# Altium schematic sheet cond_sinais.SchDoc: Condicionamento
size A4; Author: Matheus Gois Vieira; Organization: UnB; Address1: Faculdade do Gama
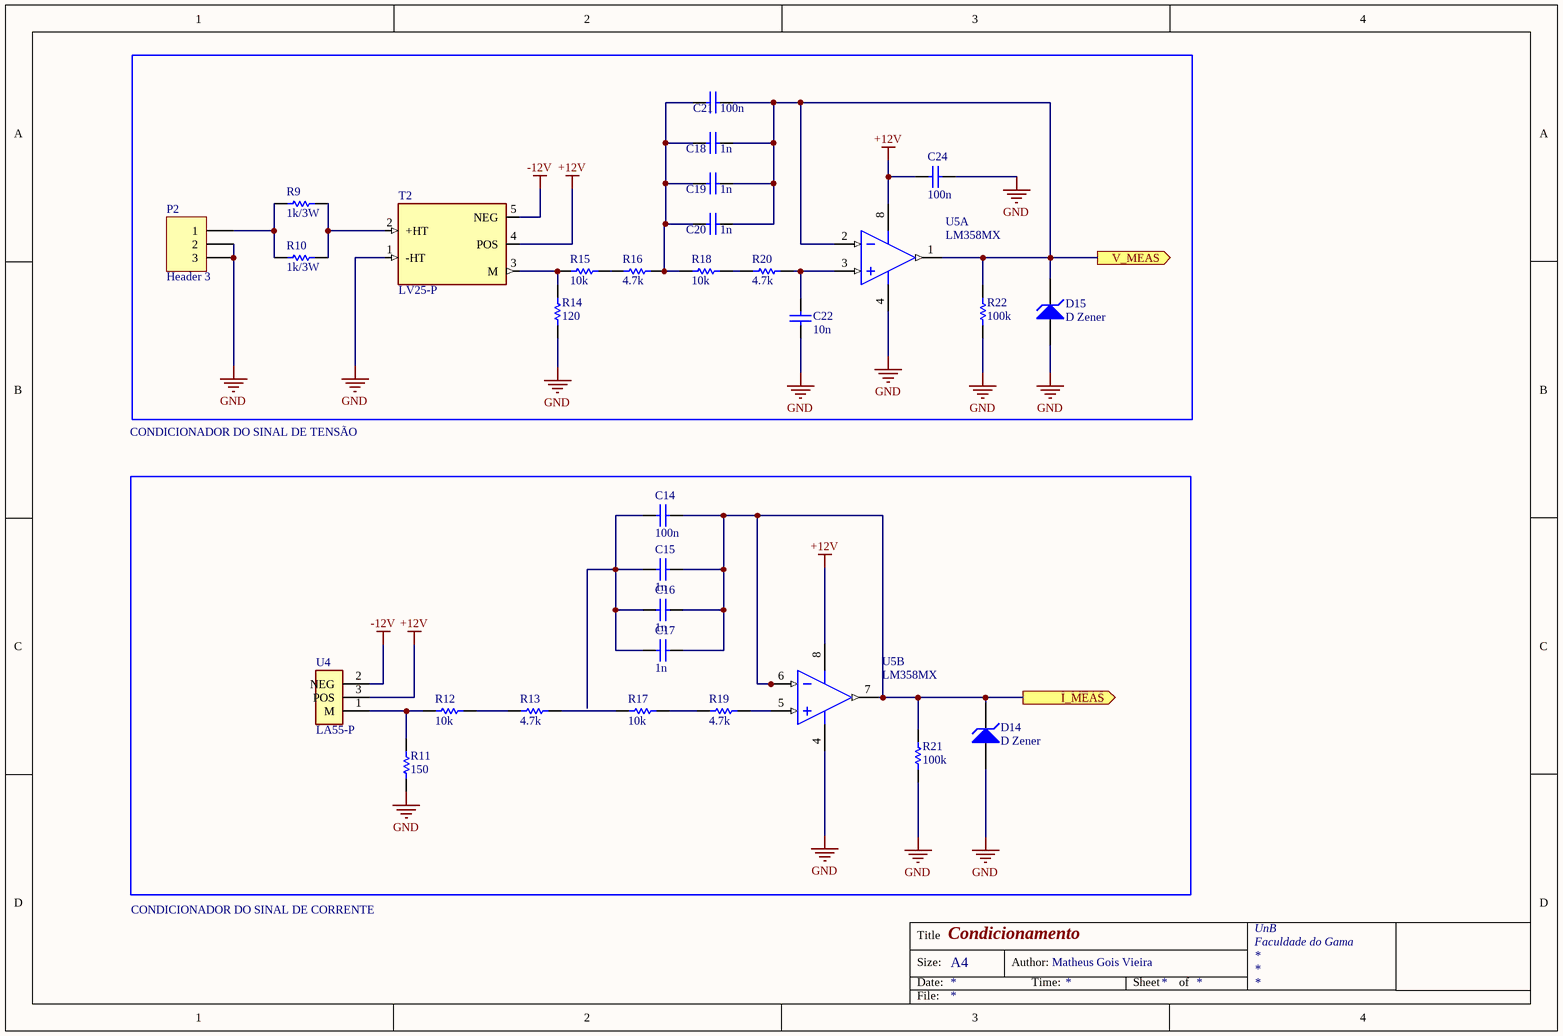
[diagram p0: cond_sinais.SchDoc]

## Parts
C14  100n  [C0603[0201]]
C15  1n  [C0603[0201]]
C16  1n  [C0603[0201]]
C17  1n  [C0603[0201]]
C18  1n  [C0603[0201]]
C19  1n  [C0603[0201]]
C20  1n  [C0603[0201]]
C21  100n  [C0603[0201]]
C22  10n  [C0603[0201]]
C24  100n  [C0603[0201]]
D14  D Zener  [DIODE-SIGNAL]
D15  D Zener  [DIODE-SIGNAL]
P2  Header 3  [HDR1X3]
R9  1k/3W  [R1005[0402]]
R10  1k/3W  [R1005[0402]]
R11  150  [R1005[0402]]
R12  10k  [R1608[0603]]
R13  4.7k  [R1005[0402]]
R14  120  [R1005[0402]]
R15  10k  [R1608[0603]]
R16  4.7k  [R1005[0402]]
R17  10k  [R1005[0402]]
R18  10k  [R1005[0402]]
R19  4.7k  [R1005[0402]]
R20  4.7k  [R1005[0402]]
R21  100k  [R1005[0402]]
R22  100k  [R1005[0402]]
T2  LV25-P  [XDCR_LV25-P]
U4  LA55-P  [XDCR_LA55-P]
U5  LM358MX  [M08A_N]  (parts A,B of 2)

## Ports
I_MEAS (out), V_MEAS (out)

## Nets
+12V: C24.2 T2.4(POS) U4.3(POS) U5.8(V+)
-12V: T2.5(NEG) U4.2(NEG)
GND: C22.1 C24.1 D14.1(A) D15.1(A) P2.2 P2.3 R11.1 R14.1 R21.1 R22.1 T2.1(-HT) U5.4(GND)
I_MEAS: C14.2 C15.2 C16.2 C17.2 D14.2(K) R21.2 U5.6(INB-) U5.7(OUTB) ; port I_MEAS
V_MEAS: C18.2 C19.2 C20.2 C21.2 D15.2(K) R22.2 U5.1(OUTA) U5.2(INA-) ; port V_MEAS
NetC14_1: C14.1 C15.1 C16.1 C17.1
NetC18_1: C18.1 C19.1 C20.1 C21.1 R16.2 R18.1
NetC22_2: C22.2 R20.2 U5.3(INA+)
NetP2_1: P2.1 R9.1 R10.1
NetR9_2: R9.2 R10.2 T2.2(+HT)
NetR11_2: R11.2 R12.1 U4.1(M)
NetR12_2: R12.2 R13.1
NetR13_2: R13.2 R17.1
NetR14_2: R14.2 R15.1 T2.3(M)
NetR15_2: R15.2 R16.1
NetR17_2: R17.2 R19.1
NetR18_2: R18.2 R20.1
NetR19_2: R19.2 U5.5(INB+)

## Notes on the sheet
- CONDICIONADOR DO SINAL DE TENSÃO
- CONDICIONADOR DO SINAL DE CORRENTE
- Title
- Size:
- Date:
- A4
- Author:
- Time:
- Sheet
- of
- File:

## Library data of the parts
C14 C21 C22 = C: CAP CER 10000PF 50V X7R 0603; Manufacturer Part Number: C0603C103K5RACTU; Value: 1; Dielectric Material: Ceramic; Tolerance: 10%; Capacitance: 10nF; Dissipation Factor: 2.5%; Manufacturer: *; PartNumber: *; Package Type: *; Supplier 1: RSComponents; Supplier Part Number 1: 2644595P; RoHS: Yes; Category: Ceramic Capacitors; Stock 1: 387725; Pricing 1: 250=0,05400, 500=0,05000, 1000=0,04800, 2500=0,04300 (GBP); Mount: Surface Mount,PCB; Case/Package: 0603; Number of Pins: 2; Case Code (Metric): 1608; Case Code (Imperial): 0603; Contact Plating: Tin,Matte; Min Operating Temperature: -55°C; Max Operating Temperature: 125°C; Voltage Rating: 50V; Voltage Rating (DC): 50V; Packaging: Tape and Reel; Termination: SMD/SMT; Package Quantity: 4000; Dielectric: X7R; Series: C0603C; Voltage: 50V; Construction: Flat; Length: 1.6mm; Width: 0.8mm; Height: 0.8mm; Depth: 0.8mm; Thickness: 0.034inch; Lead Pitch: 0.7mm; Radiation Hardening: No; REACH SVHC: No SVHC; RoHS Compliant: Yes
C15-C20 = C: Cap Ceramic 0.001uF 50V X7R 10% SMD 0603 125C T/R; Manufacturer Part Number: C0603C102K5RACTU; Value: 1; Capacitance: 1nF; Dissipation Factor: 2.5%; Manufacturer: *; PartNumber: *; Package Type: *; Supplier 1: RSComponents; Supplier Part Number 1: 2644551P; RoHS: Yes; Category: Ceramic Capacitors; Stock 1: 567675; Pricing 1: 250=0,02400, 1250=0,01600, 2500=0,01500, 12500=0,00800 (GBP); Mount: Surface Mount,PCB; Case/Package: 0603; Number of Pins: 2; Case Code (Imperial): 0603; Case Code (Metric): 1608; Dielectric Material: Ceramic; Contact Plating: Tin,Matte; Min Operating Temperature: -55°C; Max Operating Temperature: 125°C; Tolerance: 10%; Packaging: Tape and Reel; Voltage Rating: 50V; Voltage Rating (DC): 50V; Termination: SMD/SMT; Package Quantity: 1; Dielectric: X7R; Series: C; Voltage: 50V; Construction: Flat; Length: 1.6mm; Width: 0.8mm; Height: 0.8mm; Depth: 0.8mm; Thickness: 0.034inch; Lead Pitch: 0.7mm; Radiation Hardening: No; REACH SVHC: No SVHC; RoHS Compliant: Yes
C24 = C: 贴片陶瓷电容 0.1uF ±10% 50V X7R 0603; Manufacturer Part Number: C0603C104K5RACTU; Value: 1; Dielectric Material: Ceramic; Capacitance: 100nF; Dissipation Factor: 2.5%; Manufacturer: *; PartNumber: *; Package Type: *; Supplier 1: RSComponents; Supplier Part Number 1: 8015347; RoHS: Yes; Category: Ceramic Capacitors; Stock 1: 5000; Pricing 1: 1000=0,04900 (GBP); Mount: Surface Mount; Case/Package: 0603; Number of Pins: 2; Case Code (Metric): 1608; Case Code (Imperial): 0603; Contact Plating: Tin,Matte; Min Operating Temperature: -55°C; Max Operating Temperature: 125°C; Voltage Rating (DC): 50V; Tolerance: 10%; Voltage Rating: 50V; Packaging: Tape and Reel; Termination: SMD/SMT; Package Quantity: 1; Dielectric: X7R; Series: SMD Comm X7R; Voltage: 50V; Length: 0.063inch; Width: 0.031inch; Height: 0.8mm; Depth: 0.8mm; Thickness: 0.034inch; Lead Pitch: 0.7mm; Radiation Hardening: No; REACH SVHC: No SVHC; RoHS Compliant: Yes
D14 D15 = D Zener: Diode Zener Single 9.1V 5% 500mW 2-Pin(1+Tab) Power Mite T/R; Manufacturer Part Number: 1PMT5924BT1G; Test Current: 41.2mA; Max Power Dissipation: 3.2W; Impedance: 4R; Max Reverse Leakage Current: 5uA; Voltage Rating (DC): 6.2V; ESD Protection: Yes; Manufacturer: *; PartNumber: *; Package Type: *; Supplier 1: Newark; Supplier Part Number 1: 70K6994; RoHS: Yes; Category: Zener Diodes; Pricing 1: 1=0,25500, 3000=0,25500, 9000=0,23200, 24000=0,21400, 45000=0,20000 (USD); Case/Package: DO-216AA; Number of Pins: 2; Contact Plating: Tin,Matte; Min Operating Temperature: -55°C; Max Operating Temperature: 150°C; Packaging: Tape and Reel; Zener Voltage: 9.1V; Voltage Tolerance: 5%; Power Dissipation: 500mW; Element Configuration: Single; Package Quantity: 1; Tolerance: 5%; Power Rating: 3.2W; Breakdown Voltage: 6.2V; Length: 2.18mm; Width: 2.05mm; Height: 1.15mm; Radiation Hardening: No; Lead Free: Lead Free; RoHS Compliant: Yes; Halogen Free: Halogen Free; ComponentLink1URL: https://datasheet.ciiva.com/4735/1pmt5920b-d-40129-4735077.pdf?src-supplier=Mouser; ComponentLink1Description: https://datasheet.ciiva.com/4735/1pmt5920b-d-40129-4735077.pdf?src-supplier=Mouser; ComponentLink2URL: https://datasheet.ciiva.com/26092/1pmt5920b-d-26092383.pdf?src-supplier=Avnet+Europe; ComponentLink2Description: https://datasheet.ciiva.com/26092/1pmt5920b-d-26092383.pdf?src-supplier=Avnet+Europe; ComponentLink3URL: https://datasheet.ciiva.com/10638/1pmt5920b-d-10638985.pdf?src-supplier=Avnet; ComponentLink3Description: https://datasheet.ciiva.com/10638/1pmt5920b-d-10638985.pdf?src-supplier=Avnet
P2 = Header 3: Header, 3-Pin; LatestRevisionDate: 17-Jul-2002; LatestRevisionNote: Re-released for DXP Platform.; Publisher: Altium Limited
R9 R10 = R: Res Thick Film 2512 1K Ohm 5% 3W ±100ppm/C Pad SMD T/R; Manufacturer Part Number: 35221K0JT; Value: 0; Resistance: 1kR; Voltage Rating: 250V; Number of Resistors: 1; Temperature Coefficient: 100ppm/°C; Manufacturer: *; PartNumber: *; Package Type: *; Supplier 1: RSComponents; Supplier Part Number 1: 8711121P; RoHS: Yes; Category: Chip SMD Resistors; Stock 1: 17080; Pricing 1: 100=0,59300, 250=0,55500, 500=0,51700, 1000=0,47200 (GBP); Mount: Surface Mount; Case/Package: 2512; Case Code (Metric): 6432; Case Code (Imperial): 2512; Min Operating Temperature: -55°C; Max Operating Temperature: 105°C; Power Rating: 3W; Packaging: Tape and Reel; Resistor Type: Thick Film,Power resistor; Termination: Solder; Tolerance: 5%; Voltage Rating (DC): 250V; Number of Terminations: 2; Length: 6.35mm; Height: 1.1mm; Depth: 3.2mm; REACH SVHC: Unknown; RoHS Compliant: Yes; ComponentLink1URL: http://www.farnell.com/datasheets/2007092.pdf?src-supplier=Farnell; ComponentLink1Description: http://www.farnell.com/datasheets/2007092.pdf?src-supplier=Farnell; ComponentLink2URL: http://uk.rs-online.com/webdocs/142d/0900766b8142d11a.pdf?src-supplier=RSComponents; ComponentLink2Description: http://uk.rs-online.com/webdocs/142d/0900766b8142d11a.pdf?src-supplier=RSComponents; ComponentLink3URL: http://www.farnell.com/datasheets/2007092.pdf?src-supplier=Element14; ComponentLink3Description: http://www.farnell.com/datasheets/2007092.pdf?src-supplier=Element14; ComponentLink4URL: https://www.te.com/commerce/DocumentDelivery/DDEController?Action=srchrtrv&amp;DocNm=9-1773463-7&amp;DocType=DS&amp;DocLang=English&src-supplier=Digi-Key; ComponentLink4Description: https://www.te.com/commerce/DocumentDelivery/DDEController?Action=srchrtrv&amp;DocNm=9-1773463-7&amp;DocType=DS&amp;DocLang=English&src-supplier=Digi-Key; ComponentLink5URL: https://www.te.com/commerce/DocumentDelivery/DDEController?Action=srchrtrv&DocNm=9-1773463-7&DocType=DS&DocLang=English&src-supplier=Digi-Key; ComponentLink5Description: https://www.te.com/commerce/DocumentDelivery/DDEController?Action=srchrtrv&DocNm=9-1773463-7&DocType=DS&DocLang=English&src-supplier=Digi-Key
R11 = R: 贴片电阻 150Ω ±1% 1/4W ±100ppm/℃ 1206; Manufacturer Part Number: ERJ-8ENF1500V; Value: 0; Resistance: 150R; Temperature Coefficient: 100ppm/°C; Voltage Rating: 200V; Power Rating: 250mW; Manufacturer: *; PartNumber: *; Package Type: *; Supplier 1: RSComponents; Supplier Part Number 1: 1117993; RoHS: Yes; Category: Chip SMD Resistors; Stock 1: 265000; Pricing 1: 5000=0,01600 (GBP); Mount: Surface Mount; Case/Package: 1206; Number of Pins: 2; Contact Plating: Tin; Case Code (Imperial): 1206; Case Code (Metric): 3216; Min Operating Temperature: -55°C; Max Operating Temperature: 155°C; Tolerance: 1%; Resistor Type: Thick Film; Packaging: Tape and Reel; Package Quantity: 1; Number of Terminations: 2; Termination: SMD/SMT; Max Power Dissipation: 250mW; Voltage Rating (DC): 200V; Features: Automotive AEC-Q200; Series: ERJ; Resistance Tolerance: 1%; Construction: Rectangular; Length: 3.2mm; Width: 1.6mm; Height: 0.028inch; Depth: 1.6mm; Radiation Hardening: No; REACH SVHC: No SVHC; Military Standard: Not; RoHS Compliant: Yes; Lead Free: Lead Free; ComponentLink1URL: https://datasheet.ciiva.com/7886/426256-7886773.pdf?src-supplier=Element14; ComponentLink1Description: https://datasheet.ciiva.com/7886/426256-7886773.pdf?src-supplier=Element14; ComponentLink2URL: https://datasheet.ciiva.com/7887/426256-7887037.pdf?src-supplier=Element14; ComponentLink2Description: https://datasheet.ciiva.com/7887/426256-7887037.pdf?src-supplier=Element14; ComponentLink3URL: https://datasheet.ciiva.com/28569/1678782-28569020.pdf?src-supplier=Element14; ComponentLink3Description: https://datasheet.ciiva.com/28569/1678782-28569020.pdf?src-supplier=Element14; ComponentLink4URL: https://datasheet.ciiva.com/46420/1678782-46420325.pdf?src-supplier=Element14; ComponentLink4Description: https://datasheet.ciiva.com/46420/1678782-46420325.pdf?src-supplier=Element14; ComponentLink5URL: https://datasheet.ciiva.com/24024/aoa0000ce2-24024741.pdf?src-supplier=Mouser; ComponentLink5Description: https://datasheet.ciiva.com/24024/aoa0000ce2-24024741.pdf?src-supplier=Mouser; ComponentLink6URL: https://datasheet.ciiva.com/16770/70260748-16770573.pdf?src-supplier=Allied+Electronics; ComponentLink6Description: https://datasheet.ciiva.com/16770/70260748-16770573.pdf?src-supplier=Allied+Electronics; ComponentLink7URL: https://datasheet.ciiva.com/9117/aoa0000ce2-9117274.pdf?src-supplier=Avnet; ComponentLink7Description: https://datasheet.ciiva.com/9117/aoa0000ce2-9117274.pdf?src-supplier=Avnet; ComponentLink8URL: https://datasheet.ciiva.com/30151/aoa0000ce2-30151710.pdf?src-supplier=Onlinecomponents.com; ComponentLink8Description: https://datasheet.ciiva.com/30151/aoa0000ce2-30151710.pdf?src-supplier=Onlinecomponents.com; ComponentLink9URL: https://datasheet.ciiva.com/17207/aoa0000ce2-17207398.pdf?src-supplier=Avnet+Europe; ComponentLink9Description: https://datasheet.ciiva.com/17207/aoa0000ce2-17207398.pdf?src-supplier=Avnet+Europe; ComponentLink10URL: https://datasheet.ciiva.com/16513/aoa0000ce2-16513583.pdf?src-supplier=Avnet+Asia; ComponentLink10Description: https://datasheet.ciiva.com/16513/aoa0000ce2-16513583.pdf?src-supplier=Avnet+Asia
R12 R15 R17 R18 = R: Res, 10K, 0.01%, 0.25W, 1206, Metal Foil; Manufacturer Part Number: Y163010K0000T9R; Value: 0; Resistance: 10kR; Max Power Dissipation: 250mW; Temperature Coefficient: 0.2ppm/°C; Manufacturer: *; PartNumber: *; Package Type: *; Supplier 1: Digi-Key; Supplier Part Number 1: Y1630-10.0KBCT-ND; RoHS: Yes; Category: Chip SMD Resistors; Stock 1: 1437; Pricing 1: 1=11,40000, 10=10,36300, 25=9,32640, 50=8,03100, 100=7,38340 (USD); Case/Package: 1206; Case Code (Metric): 3216; Case Code (Imperial): 1206; Min Operating Temperature: -55°C; Max Operating Temperature: 150°C; Package Quantity: 1; Packaging: Tape and Reel; Tolerance: 0.01%; Resistor Type: Metal Foil; Number of Terminations: 2; Features: Moisture Resistant,Anti-Sulfur; Length: 0.126inch; Width: 0.062inch; Height: 0.025inch; RoHS Compliant: Yes; ComponentLink1URL: https://datasheet.ciiva.com/29711/vfcpseri-29711161.pdf?src-supplier=Digi-Key; ComponentLink1Description: https://datasheet.ciiva.com/29711/vfcpseri-29711161.pdf?src-supplier=Digi-Key; ComponentLink2URL: https://datasheet.ciiva.com/29711/vfcpseri-29711162.pdf?src-supplier=Digi-Key; ComponentLink2Description: https://datasheet.ciiva.com/29711/vfcpseri-29711162.pdf?src-supplier=Digi-Key; ComponentLink3URL: https://datasheet.ciiva.com/18610/vfcpseri-18610015.pdf?src-supplier=Digi-Key; ComponentLink3Description: https://datasheet.ciiva.com/18610/vfcpseri-18610015.pdf?src-supplier=Digi-Key
R13 R16 R19 R20 = R: Res Thick Film 1206 4.7K Ohm 5% 1/4W ±200ppm/°C Molded SMD Punched Carrier T/R; Manufacturer Part Number: ERJ-8GEYJ472V; Value: 0; Resistance: 4.7kR; Voltage Rating: 200V; Power Rating: 250mW; Manufacturer: *; PartNumber: *; Package Type: *; Supplier 1: Newark; Supplier Part Number 1: 65T8944; RoHS: Yes; Category: Chip SMD Resistors; Stock 1: 49650; Pricing 1: 1=0,20200, 25=0,15000, 50=0,10600, 100=0,06200, 250=0,05000, 500=0,03600, 1000=0,02400 (USD); Mount: Surface Mount; Case/Package: 1206; Contact Plating: Tin; Case Code (Imperial): 1206; Case Code (Metric): 3216; Size Code: 1206; Min Operating Temperature: -55°C; Max Operating Temperature: 155°C; Tolerance: 5%; Resistor Type: Thick Film; Temperature Coefficient: 200ppm/°C; Packaging: Tape and Reel; Package Quantity: 1; Termination: SMD/SMT; Number of Terminations: 2; Max Power Dissipation: 250mW; Voltage Rating (DC): 200V; Features: Automotive AEC-Q200; Series: ERJ; Resistance Tolerance: 5%; Construction: Rectangular; Length: 3.2mm; Width: 1.6mm; Height: 0.028inch; Depth: 1.6mm; Radiation Hardening: No; REACH SVHC: No SVHC; Military Standard: Not; Lead Free: Lead Free; RoHS Compliant: Yes; ComponentLink1URL: https://datasheet.ciiva.com/22781/1500035-22781542.pdf?src-supplier=Farnell; ComponentLink1Description: https://datasheet.ciiva.com/22781/1500035-22781542.pdf?src-supplier=Farnell; ComponentLink2URL: https://datasheet.ciiva.com/46377/1500035-46377622.pdf?src-supplier=Element14; ComponentLink2Description: https://datasheet.ciiva.com/46377/1500035-46377622.pdf?src-supplier=Element14; ComponentLink3URL: https://datasheet.ciiva.com/28514/1678796-28514270.pdf?src-supplier=Element14; ComponentLink3Description: https://datasheet.ciiva.com/28514/1678796-28514270.pdf?src-supplier=Element14; ComponentLink4URL: https://datasheet.ciiva.com/28683/1678796-28683449.pdf?src-supplier=Element14; ComponentLink4Description: https://datasheet.ciiva.com/28683/1678796-28683449.pdf?src-supplier=Element14; ComponentLink5URL: https://datasheet.ciiva.com/16774/70255313-16774777.pdf?src-supplier=Allied+Electronics; ComponentLink5Description: https://datasheet.ciiva.com/16774/70255313-16774777.pdf?src-supplier=Allied+Electronics; ComponentLink6URL: https://datasheet.ciiva.com/9195/aoa0000ce1-9195692.pdf?src-supplier=Avnet; ComponentLink6Description: https://datasheet.ciiva.com/9195/aoa0000ce1-9195692.pdf?src-supplier=Avnet; ComponentLink7URL: https://datasheet.ciiva.com/16508/aoa0000ce1-16508170.pdf?src-supplier=Future+Electronics; ComponentLink7Description: https://datasheet.ciiva.com/16508/aoa0000ce1-16508170.pdf?src-supplier=Future+Electronics; ComponentLink8URL: https://datasheet.ciiva.com/15159/getdatasheetpartid-250262-15159117.pdf?src-supplier=Verical; ComponentLink8Description: https://datasheet.ciiva.com/15159/getdatasheetpartid-250262-15159117.pdf?src-supplier=Verical; ComponentLink9URL: https://datasheet.ciiva.com/48531/aoa0000ce1-48531983.pdf?src-supplier=Avnet; ComponentLink9Description: https://datasheet.ciiva.com/48531/aoa0000ce1-48531983.pdf?src-supplier=Avnet; ComponentLink10URL: https://datasheet.ciiva.com/30085/4aoa0000ce1-30085593.pdf?src-supplier=Onlinecomponents.com; ComponentLink10Description: https://datasheet.ciiva.com/30085/4aoa0000ce1-30085593.pdf?src-supplier=Onlinecomponents.com; ComponentLink11URL: https://datasheet.ciiva.com/17213/aoa0000ce1-17213195.pdf?src-supplier=Avnet+Europe; ComponentLink11Description: https://datasheet.ciiva.com/17213/aoa0000ce1-17213195.pdf?src-supplier=Avnet+Europe; ComponentLink12URL: https://datasheet.ciiva.com/16512/aoa0000ce1-16512492.pdf?src-supplier=Avnet+Asia; ComponentLink12Description: https://datasheet.ciiva.com/16512/aoa0000ce1-16512492.pdf?src-supplier=Avnet+Asia
R14 = R: Resistor Thick Film 1206 120 Ohm 5% 1/4W 200ppm/C Molded SMD Punched Carrier T/R; Manufacturer Part Number: ERJ-8GEYJ121V; Value: 0; Resistance: 120R; Temperature Coefficient: 200ppm/°C; Power Rating: 250mW; Voltage Rating: 200V; Manufacturer: *; PartNumber: *; Package Type: *; Supplier 1: Newark; Supplier Part Number 1: 65T8900; RoHS: Yes; Category: Chip SMD Resistors; Stock 1: 48088; Pricing 1: 1=0,01500, 25=0,01500, 50=0,01500, 100=0,01500, 250=0,01500, 500=0,01500, 1000=0,01500 (USD); Mount: Surface Mount; Case/Package: 1206; Contact Plating: Tin; Case Code (Imperial): 1206; Case Code (Metric): 3216; Min Operating Temperature: -55°C; Max Operating Temperature: 155°C; Tolerance: 5%; Resistor Type: Thick Film; Packaging: Tape and Reel; Package Quantity: 1; Termination: SMD/SMT; Number of Terminations: 2; Max Power Dissipation: 250mW; Voltage Rating (DC): 200V; Features: Automotive AEC-Q200; Series: ERJ; Technology: THICK FILM; Resistance Tolerance: 5%; Construction: Rectangular; Length: 3.2mm; Width: 1.6mm; Height: 0.6mm; Depth: 1.6mm; Radiation Hardening: No; REACH SVHC: No SVHC; Military Standard: Not; Lead Free: Lead Free; RoHS Compliant: Yes; ComponentLink1URL: https://datasheet.ciiva.com/9117/aoa0000ce1-9117308.pdf?src-supplier=Avnet; ComponentLink1Description: https://datasheet.ciiva.com/9117/aoa0000ce1-9117308.pdf?src-supplier=Avnet; ComponentLink2URL: https://datasheet.ciiva.com/28587/1678796-28587292.pdf?src-supplier=Element14; ComponentLink2Description: https://datasheet.ciiva.com/28587/1678796-28587292.pdf?src-supplier=Element14; ComponentLink3URL: https://datasheet.ciiva.com/16780/70255313-16780489.pdf?src-supplier=Allied+Electronics; ComponentLink3Description: https://datasheet.ciiva.com/16780/70255313-16780489.pdf?src-supplier=Allied+Electronics; ComponentLink4URL: https://datasheet.ciiva.com/16781/70255313-16781182.pdf?src-supplier=Allied+Electronics; ComponentLink4Description: https://datasheet.ciiva.com/16781/70255313-16781182.pdf?src-supplier=Allied+Electronics; ComponentLink5URL: https://datasheet.ciiva.com/28681/1678796-28681557.pdf?src-supplier=Element14; ComponentLink5Description: https://datasheet.ciiva.com/28681/1678796-28681557.pdf?src-supplier=Element14; ComponentLink6URL: https://datasheet.ciiva.com/46377/1500035-46377051.pdf?src-supplier=Element14; ComponentLink6Description: https://datasheet.ciiva.com/46377/1500035-46377051.pdf?src-supplier=Element14
R21 R22 = R: 贴片电阻 100KΩ ±1% 1/4W ±100ppm/℃ 1206; Manufacturer Part Number: ERJ-8ENF1003V; Value: 0; Resistance: 100kR; Temperature Coefficient: 100ppm/°C; Power Rating: 250mW; Voltage Rating: 200V; Manufacturer: *; PartNumber: *; Package Type: *; Supplier 1: RSComponents; Supplier Part Number 1: 1763633; RoHS: Yes; Category: Chip SMD Resistors; Stock 1: 128000; Pricing 1: 1000=0,01400 (GBP); Mount: Surface Mount; Case/Package: 1206; Number of Pins: 2; Contact Plating: Tin; Case Code (Imperial): 1206; Case Code (Metric): 3216; Size Code: 1206; Min Operating Temperature: -55°C; Max Operating Temperature: 155°C; Tolerance: 1%; Resistor Type: Thick Film; Packaging: Tape and Reel; Package Quantity: 1; Number of Terminations: 2; Termination: Solder; Max Power Dissipation: 250mW; Voltage Rating (DC): 200V; Features: Automotive AEC-Q200; Series: ERJ; Technology: THICK FILM; Resistance Tolerance: 1%; Construction: Rectangular; Length: 3.2mm; Width: 1.6mm; Height: 0.6mm; Depth: 1.6mm; Radiation Hardening: No; REACH SVHC: No SVHC; Military Standard: Not; Lead Free: Lead Free; RoHS Compliant: Yes; ComponentLink1URL: https://datasheet.ciiva.com/34303/1990093-34303672.pdf?src-supplier=Jameco; ComponentLink1Description: https://datasheet.ciiva.com/34303/1990093-34303672.pdf?src-supplier=Jameco; ComponentLink2URL: https://datasheet.ciiva.com/7830/426256-7830761.pdf?src-supplier=Element14; ComponentLink2Description: https://datasheet.ciiva.com/7830/426256-7830761.pdf?src-supplier=Element14; ComponentLink3URL: https://datasheet.ciiva.com/22687/1678782-22687453.pdf?src-supplier=Element14; ComponentLink3Description: https://datasheet.ciiva.com/22687/1678782-22687453.pdf?src-supplier=Element14; ComponentLink4URL: https://datasheet.ciiva.com/46372/1678782-46372703.pdf?src-supplier=Element14; ComponentLink4Description: https://datasheet.ciiva.com/46372/1678782-46372703.pdf?src-supplier=Element14; ComponentLink5URL: https://datasheet.ciiva.com/16773/70260748-16773850.pdf?src-supplier=Allied+Electronics; ComponentLink5Description: https://datasheet.ciiva.com/16773/70260748-16773850.pdf?src-supplier=Allied+Electronics; ComponentLink6URL: https://datasheet.ciiva.com/16763/70260748-16763942.pdf?src-supplier=Allied+Electronics; ComponentLink6Description: https://datasheet.ciiva.com/16763/70260748-16763942.pdf?src-supplier=Allied+Electronics; ComponentLink7URL: https://datasheet.ciiva.com/16427/aoa0000ce2-16427657.pdf?src-supplier=Future+Electronics; ComponentLink7Description: https://datasheet.ciiva.com/16427/aoa0000ce2-16427657.pdf?src-supplier=Future+Electronics; ComponentLink8URL: https://datasheet.ciiva.com/30179/aoa0000ce2-30179663.pdf?src-supplier=Onlinecomponents.com; ComponentLink8Description: https://datasheet.ciiva.com/30179/aoa0000ce2-30179663.pdf?src-supplier=Onlinecomponents.com; ComponentLink9URL: https://datasheet.ciiva.com/17208/aoa0000ce2-17208157.pdf?src-supplier=Avnet+Europe; ComponentLink9Description: https://datasheet.ciiva.com/17208/aoa0000ce2-17208157.pdf?src-supplier=Avnet+Europe; ComponentLink10URL: https://datasheet.ciiva.com/16513/aoa0000ce2-16513887.pdf?src-supplier=Avnet+Asia; ComponentLink10Description: https://datasheet.ciiva.com/16513/aoa0000ce2-16513887.pdf?src-supplier=Avnet+Asia
T2 = LV25-P: Hall Effect Voltage Transducer; Manufacturer: LEM; MF: LEM USA Inc.; Secondary Current: 25mA; Min Supply Voltage: -15V; Max Supply Voltage: 15V; Response Time: 40us; Input Current: 10mA; Accuracy: 0.9%; Overall Height: 16.45mm; Overall Depth: 29.2mm; SnapEDA_Link: https://www.snapeda.com/parts/LV%2025-P/LEM%20USA%20Inc./view-part/5138977/?ref=snap; Digi-Key_Part_Number: 398-1019-ND; Value: *; Check_prices: https://www.snapeda.com/parts/LV%2025-P/LEM%20USA%20Inc./view-part/5138977/?ref=eda; MP: LV 25-P; Package: None; Supplier 1: RSComponents; Supplier Part Number 1: 286361; Manufacturer Part Number: LV25-P; RoHS: Yes; Category: Sensors; Stock 1: 192; Pricing 1: 1=61,91000, 5=60,03000, 10=57,47000 (GBP); Mount: PCB; Min Operating Temperature: 0°C; Max Operating Temperature: 70°C; Max Output Current: 25mA; Current Rating: 10mA; Output Type: Voltage; Series: LV; Width: 26mm; Height: 15.1mm; RoHS Compliant: Yes; REACH SVHC: No SVHC; Lead Free: Contains Lead; ComponentLink1URL: https://datasheet.ciiva.com/1309/51633-1309046.pdf?src-supplier=Newark; ComponentLink1Description: https://datasheet.ciiva.com/1309/51633-1309046.pdf?src-supplier=Newark; ComponentLink2URL: https://datasheet.ciiva.com/1323/1683367-1323916.pdf?src-supplier=Element14; ComponentLink2Description: https://datasheet.ciiva.com/1323/1683367-1323916.pdf?src-supplier=Element14; ComponentLink3URL: https://datasheet.ciiva.com/3327/lv25p-eng-tds-3327492.pdf?src-supplier=Distrelec; ComponentLink3Description: https://datasheet.ciiva.com/3327/lv25p-eng-tds-3327492.pdf?src-supplier=Distrelec; ComponentLink4URL: https://datasheet.ciiva.com/2846/lv2025-p-2846642.pdf?src-supplier=Digi-Key; ComponentLink4Description: https://datasheet.ciiva.com/2846/lv2025-p-2846642.pdf?src-supplier=Digi-Key; ComponentLink5URL: https://datasheet.ciiva.com/26929/lv25-p-26929502.pdf?src-supplier=IIIC; ComponentLink5Description: https://datasheet.ciiva.com/26929/lv25-p-26929502.pdf?src-supplier=IIIC
U4 = LA55-P: Current Sensor 50A 1 Channel Hall Effect, Closed Loop Bidirectional Module, Single Pass Through; MF: LEM USA; MP: LA 55-P; Availability: Unavailable; SnapEDA_Link: https://www.snapeda.com/parts/LA%2055-P/LEM%20USA%20Inc./view-part/38924/?ref=snap; Value: *; Package: Module LEM USA; Price: None
U5 = LM358MX: LM358 Series 7 mV Input Offset Dual Operational Amplifier - SOIC-8; Manufacturer: National Semiconductor; PackageTopMarking: NSZXTT*LM*358M; PowerWise: N; CompType: Amplifiers; High-Reliability: Y; Min Supply Voltage: 3V; Max Supply Voltage: 32V; Min Dual Supply Voltage: 1.5V; Max Dual Supply Voltage: 16V; Voltage Gain: 100dB; Slew Rate: 0.1V/µs; Output Current: 30mA; Nominal Supply Current: 500uA; Common Mode Rejection Ratio: 65dB; Number of Channels: 2; Input Offset Voltage (Vos): 7mV; Input Bias Current: 250nA; Gain Bandwidth Product: 1MHz; Operating Supply Current: 800uA; Amplifier Type: GENERAL PURPOSE; Power Dissipation: 530mW; DatasheetVersion: Oct-2005; PackageVersion: revM, May-2009; PackageReference: M08A; PackageDescription: SOIC Narrow, 4.9 x 3.9 x 1.45mm, 8 Lead, 1.27mm Pitch; PartNumber: LM358MX; RoHS: N; PinCount: 8; Code_JEDEC: MS-012-AA; Code_IPC: SOIC127P600-8; ComponentLink1Description: Manufacturer URL; ComponentLink1URL: http://www.national.com/; ComponentLink2Description: LM358 Datasheet; ComponentLink2URL: http://www.national.com/ds/LM/LM358.pdf; ComponentLink3Description: LM358 Web Page; ComponentLink3URL: http://www.national.com/pf/LM/LM358.html; ComponentLink4Description: M08A Package Page; ComponentLink4URL: http://www.national.com/packaging/folders/m08a.html; Supplier 1: Mouser; Supplier Part Number 1: 926-LM358MX; Manufacturer Part Number: LM358MX; Category: Amplifiers - Op Amps, Buffer, Instrumentation; Stock 1: 19; Pricing 1: 1=1,34000, 10=1,21000, 50=1,15000, 100=0,93900, 1000=0,61300, 10000=0,59200 (USD); Mount: Surface Mount; Case/Package: SOIC; Number of Pins: 8; Min Operating Temperature: 0°C; Max Operating Temperature: 70°C; Packaging: Tape and Reel; Package Quantity: 2500; Number of Circuits: 2; Output Current per Channel: 30mA; Operating Supply Voltage: 16V; Number of Elements: 2; Power Supply Rejection Ratio (PSRR): 65dB; Technology: BIPOLAR; Unity Gain Bandwidth Product: 1MHz; Supply Current: 500uA; Radiation Hardening: No; REACH SVHC: No SVHC; Lead Free: Lead Free; RoHS Compliant: No; ComponentLink5URL: https://datasheet.ciiva.com/29305/151994-da-01-en-ic-smd-lm358mx-so8-tid-29305099.pdf?src-supplier=Conrad; ComponentLink5Description: https://datasheet.ciiva.com/29305/151994-da-01-en-ic-smd-lm358mx-so8-tid-29305099.pdf?src-supplier=Conrad; ComponentLink6URL: https://datasheet.ciiva.com/6627/lm158-n-6627893.pdf?src-supplier=Digi-Key; ComponentLink6Description: https://datasheet.ciiva.com/6627/lm158-n-6627893.pdf?src-supplier=Digi-Key; ComponentLink7URL: https://datasheet.ciiva.com/6627/lm158-n-6627894.pdf?src-supplier=Digi-Key; ComponentLink7Description: https://datasheet.ciiva.com/6627/lm158-n-6627894.pdf?src-supplier=Digi-Key